# Altium schematic sheet MARCS ARM TB ICs Schematic.SchDoc
size A
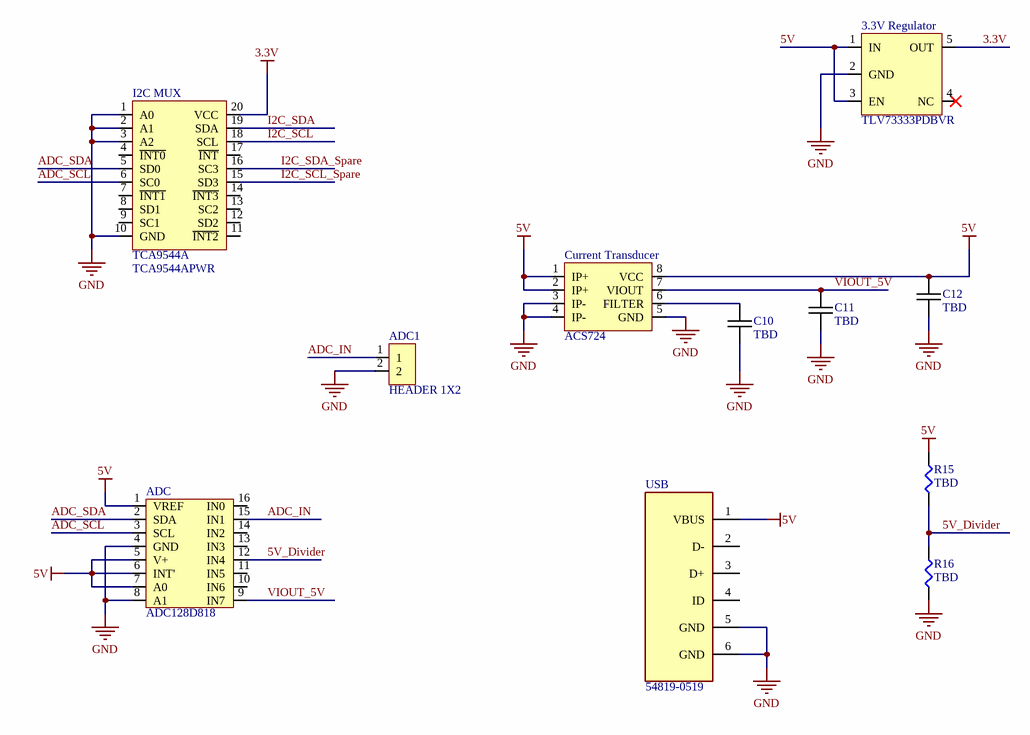
[diagram p0: MARCS ARM TB ICs Schematic.SchDoc]

## Parts
3.3V_Regulator  TLV73333PDBVR  [TLV733P]
ADC  ADC128D818  [ADC128D818 V3]
ADC1  HEADER 1X2  [Header 1x2]
C10  TBD  [0805C-GENERIC]
C11  TBD  [0805C-GENERIC]
C12  TBD  [0805C-GENERIC]
Current_Transducer  ACS724  [SOIC-8 V3]
I2C_MUX  TCA9544A  Supplier Part Number 1: TCA9544APWR  [TSSOP20]
R15  TBD  [0805R-GENERIC]
R16  TBD  [0805R-GENERIC]
USB  Part Number: 54819-0519  [Molex_54819-0519_0]  (hidden comment: Conn_Molex_54819-0519_eec)

## Nets
3.3V: 3.3V_Regulator.5(OUT) I2C_MUX.20(VCC)
5V: 3.3V_Regulator.1(IN) 3.3V_Regulator.3(EN) ADC.1(VREF) ADC.5(V+) ADC.6(INT') ADC.7(A0) C12.1 Current_Transducer.1(IP+) Current_Transducer.2(IP+) Current_Transducer.8(VCC) R15.2 USB.1(VBUS)
GND: 3.3V_Regulator.2(GND) ADC.4(GND) ADC.8(A1) ADC1.2 C10.2 C11.2 C12.2 Current_Transducer.3(IP-) Current_Transducer.4(IP-) Current_Transducer.5(GND) I2C_MUX.1(A0) I2C_MUX.2(A1) I2C_MUX.3(A2) I2C_MUX.10(GND) R16.2 USB.5(GND) USB.6(GND)
5V_Divider: ADC.12(IN4) R15.1 R16.1
ADC_IN: ADC.15(IN1) ADC1.1
ADC_SCL: ADC.3(SCL) I2C_MUX.6(SC0)
ADC_SDA: ADC.2(SDA) I2C_MUX.5(SD0)
I2C_SCL: I2C_MUX.18(SCL)
I2C_SCL_Spare: I2C_MUX.15(SD3)
I2C_SDA: I2C_MUX.19(SDA)
I2C_SDA_Spare: I2C_MUX.16(SC3)
VIOUT_5V: ADC.9(IN7) C11.1 Current_Transducer.7(VIOUT)
NetC10_1: C10.1 Current_Transducer.6(FILTER)

Not connected (* = marked no-connect by the designer): 3.3V_Regulator 4(NC)*; ADC 10(IN6) 11(IN5) 13(IN3) 14(IN2) 16(IN0); I2C_MUX 4(~{INT0}) 7(~{INT1}) 8(SD1) 9(SC1) 11(~{INT2}) 12(SD2) 13(SC2) 14(~{INT3}) 17(~{INT}); USB 2(D-) 3(D+) 4(ID)

## Notes on the sheet
- Size
- Rev
- Operated by Fermi Research Alliance, LLC under Contract No. DE-AC02-07CH11359 with the United States Department of Energy.
- Number
- B
- Date:
- Time:
- Sheet
- of
- ENGINEER:
- DRAWN:
- CHECKED:
- APPROVED:

## Library data of the parts
3.3V_Regulator = TLV733
C10-C12 = 0805C-TBD: CAPACITOR 0805 CERAMIC VALUE TO BE DETERMINED
R15 R16 = 0805R-TBD: RESISTOR 0805 VALUE TO BE DETERMINED
USB = Conn_Molex_54819-0519_eec: CONN USB - mini B USB 2.0 OTG Receptacle Connector 5 Position Through Hole, Right Angle; Manufacturer: Molex; Is Female: yes; helpURL: https://upverter.com/upn/revision/57f7d65304c3d878/; ComponentLink2Description: Datasheet; Temperature: -20°C to +85°C; Package: CONN_PTH_7MM7_9MM0_USB; Supplier 2: Mouser; Supplier 1: Digi-Key; ComponentLink1URL: https://upverter.com/upn/revision/57f7d65304c3d878/; Supplier Part Number 2: 538-54819-0519; Supplier Part Number 1: WM17115-ND; ComponentLink1Description: Upverter; ComponentLink2URL: https://upverter.com/datasheet/9d71f2f8719b3fc0715bd6f9e6d9d5a5d296bb87.pdf; RoHS: TRUE; Mouser Part Number: 538-54819-0519; Temperature Range High: +85°C; Digikey Description: CONN USB - mini B USB 2.0 OTG Receptacle Connector 5 Position Through Hole, Right Angle; Digikey Part Number: WM17115-ND; Lead Free: yes; Temperature Range Low: -20°C
I2C_MUX = TCA9544A: Supplier 1: Arrow Electronics, Inc.